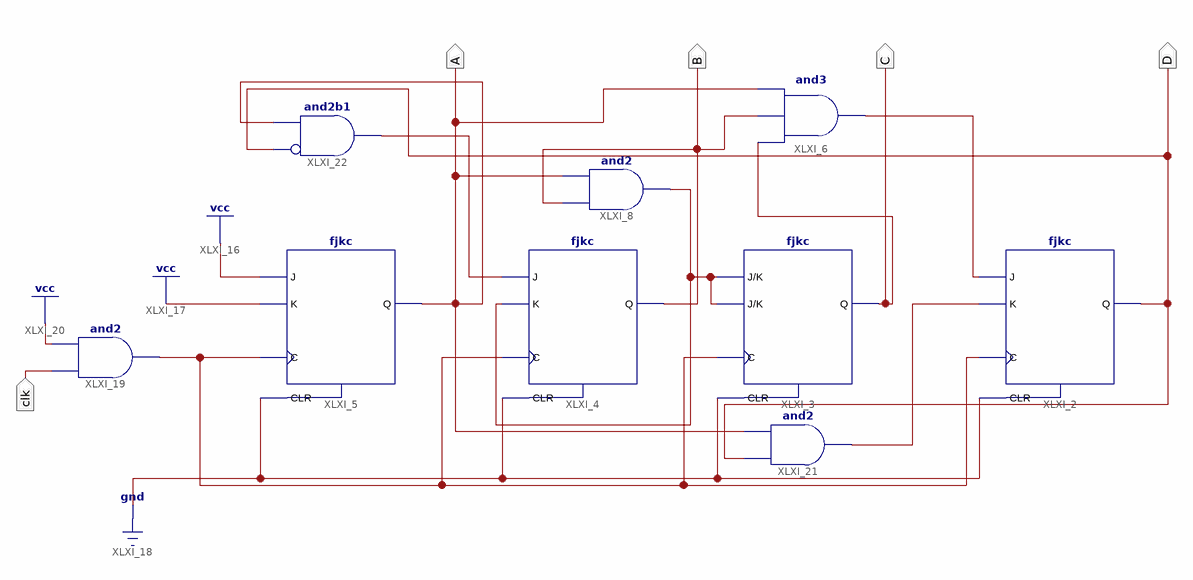
[diagram p0: schematic sheet 1]
// Xilinx ISE schematic flipflop09.sch (spartan6) as structural Verilog: 9 symbols, 5 ports
module flipflop09 (
  input  clk,
  output D,
  output A,
  output B,
  output C
);

  wire XLXN_1, XLXN_12, XLXN_28, XLXN_38, XLXN_42;

  fjkc XLXI_2 (.C(XLXN_28), .CLR(1'b0), .J(XLXN_1), .K(XLXN_42), .Q(D));
  fjkc XLXI_3 (.C(XLXN_28), .CLR(1'b0), .J(XLXN_38), .K(XLXN_38), .Q(C));
  fjkc XLXI_4 (.C(XLXN_28), .CLR(1'b0), .J(XLXN_12), .K(XLXN_38), .Q(B));
  fjkc XLXI_5 (.C(XLXN_28), .CLR(1'b0), .J(1'b1), .K(1'b1), .Q(A));
  and XLXI_6 (XLXN_1, C, B, A);
  and XLXI_8 (XLXN_38, B, A);
  and XLXI_19 (XLXN_28, clk, 1'b1);
  and XLXI_21 (XLXN_42, D, A);
  and XLXI_22 (XLXN_12, ~D, A);  // and2b1
endmodule
